# Altium schematic sheet Schema1.SchDoc
size A4; SheetNumber: 1; SheetTotal: 2
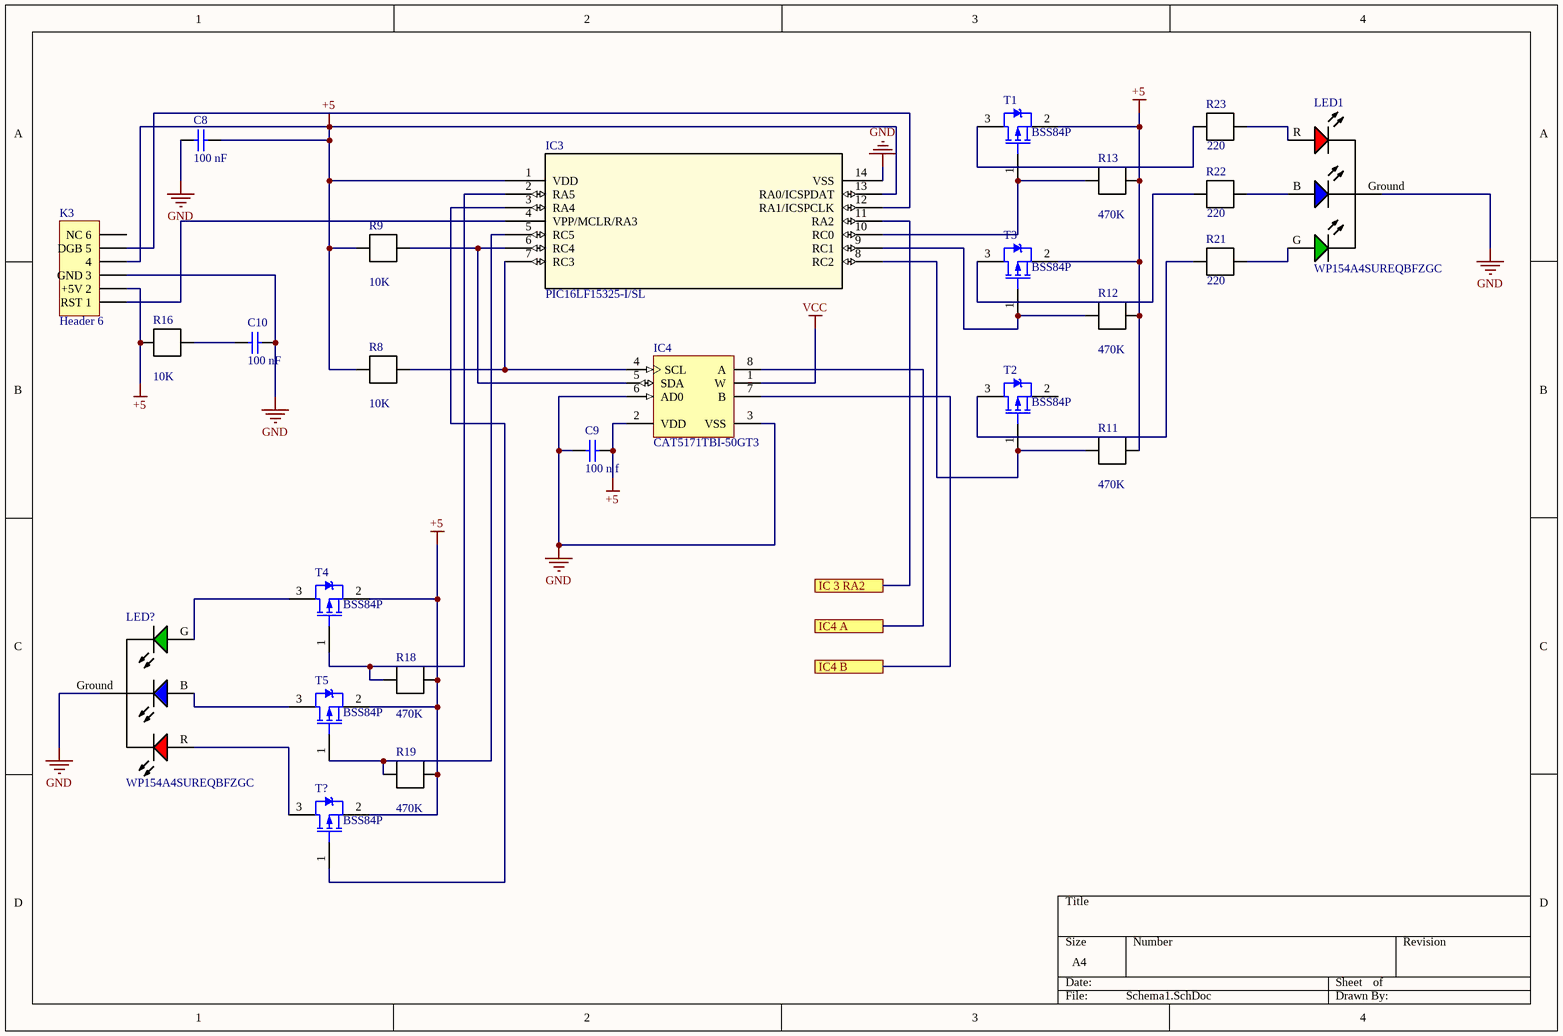
[diagram p0: Schema1.SchDoc]

## Parts
C8  100 nF  [CAPC2013X70X45NL10T25]
C9  100 n f  [CAPC2013X70X45NL10T25]
C10  100 nF  [CAPC2013X70X45NL10T25]
IC3  PIC16LF15325-I/SL  [SOIC14_SL_MCH]
IC4  CAT5171TBI-50GT3  [ONSC-SOT23-8-527AK-01_N]
K3  Header 6  [HDR1X6]
LED1  WP154A4SUREQBFZGC  [KING-WP154A4SUREQBFZGC_V]
LED?  WP154A4SUREQBFZGC  [KING-WP154A4SUREQBFZGC_V]
R8  value 10K  [6-0805_M]
R9  value 10K  [6-0805_M]
R11  value 470K  [6-0805_M]
R12  value 470K  [6-0805_M]
R13  value 470K  [6-0805_M]
R16  value 10K  [6-0805_M]
R18  value 470K  [6-0805_M]
R19  value 470K  [6-0805_M]
R21  value 220  [6-0805_M]
R22  value 220  [6-0805_M]
R23  value 220  [6-0805_M]
T1  BSS84P  [INF-PG-SOT23_N]
T2  BSS84P  [INF-PG-SOT23_N]
T3  BSS84P  [INF-PG-SOT23_N]
T4  BSS84P  [INF-PG-SOT23_N]
T5  BSS84P  [INF-PG-SOT23_N]
T?  BSS84P  [INF-PG-SOT23_N]

## Ports
IC4 A, IC4 B, IC 3 RA2

## Nets
+5: C8.2 C9.2 IC3.1(VDD) IC3.13(RA0/ICSPDAT) IC4.2(VDD) K3.2(+5V_2) K3.4 R8.1 R9.1 R11.2 R12.2 R13.2 R16.1 R18.2 R19.2 T1.2(SOURCE) T3.2(SOURCE) T4.2(SOURCE) T5.2(SOURCE) T?.2(SOURCE)
GND: C8.1 C9.1 C10.2 IC3.14(VSS) IC4.3(VSS) IC4.6(AD0) K3.3(GND_3) LED1.Ground(CATHODE) LED?.Ground(CATHODE)
VCC: IC4.1(W)
IC4 A: IC4.8(A) ; port IC4 A
IC4 B: IC4.7(B) ; port IC4 B
IC 3 RA2: IC3.11(RA2) ; port IC 3 RA2
NetC10_1: C10.1 R16.2
NetIC3_2: IC3.2(RA5) R18.1 T4.1(GATE)
NetIC3_3: IC3.3(RA4) T?.1(GATE)
NetIC3_4: IC3.4(VPP/MCLR/RA3) K3.1(RST_1)
NetIC3_5: IC3.5(RC5) R19.1 T5.1(GATE)
NetIC3_6: IC3.6(RC4) IC4.5(SDA) R9.2
NetIC3_7: IC3.7(RC3) IC4.4(SCL) R8.2
NetIC3_8: IC3.8(RC2) R11.1 T2.1(GATE)
NetIC3_9: IC3.9(RC1) R12.1 T3.1(GATE)
NetIC3_10: IC3.10(RC0) R13.1 T1.1(GATE)
NetIC3_12: IC3.12(RA1/ICSPCLK) K3.5(DGB_5)
NetLED1_B: LED1.B(BLUE) R22.2
NetLED1_G: LED1.G(GREEN) R21.2
NetLED1_R: LED1.R(RED) R23.2
NetLED?_B: LED?.B(BLUE) T5.3(DRAIN)
NetLED?_G: LED?.G(GREEN) T4.3(DRAIN)
NetLED?_R: LED?.R(RED) T?.3(DRAIN)
NetR21_1: R21.1 T2.3(DRAIN)
NetR22_1: R22.1 T3.3(DRAIN)
NetR23_1: R23.1 T1.3(DRAIN)

Not connected (* = marked no-connect by the designer): K3 6(NC_6); T2 2(SOURCE)

## Library data of the parts
C8-C10 = CMP-2007-00889-1: Manufacturer: Murata; Part Number: GRM2165C1H332JA01D
IC3 = PIC16LF15325-I/SL: No Description Available; Vendor: Microchip; Built_By: EMA_Cory; SourceLibrary: Microchip_2020-03-04; Datasheet: http://ww1.microchip.com/downloads/en/DeviceDoc/PIC16-L-F15325-45-Data-Sheet-40001865D.pdf; Manufacturer_Part_Number: PIC16LF15325-I/SL; Copyright: Copyright (C) 2018 Accelerated Designs. All rights reserved; RefDes: RefDes; Type: DEV
IC4 = CMP-1317-00202-1: 256-Position I2C Compatible Digital Potentiometer (POT), -40 to 85 degC, 8-Pin SOT23, Pb-Free, Tape and Reel; Manufacturer: On Semiconductor; # of Pots: 1; VDD Max (V): 5.5; # of Taps: 256; Code_JEDEC: MO-178; RoHS: TRUE; ComponentLink1URL: http://www.onsemi.com/; ComponentLink3URL: http://www.onsemi.com/pub_link/Collateral/527AK.PDF; PackageDescription: 8-Pin Small Outline Transistor, Body 2.9 x 1.6 mm, Pitch 0.65 mm; ComponentLink3Description: Package Specification; PackageReference: SOT23-8-527AK-01; ComponentLink1Description: Manufacturer URL; PartNumber: CAT5171TBI-50GT3; PackageVersion: Rev. A, 03/2009; Packing: Tape and Reel; DatasheetVersion: Rev. 2; Mounting Technology: Surface Mount; ComponentLink2URL: http://www.onsemi.com/pub_link/Collateral/CAT5171-D.PDF; Control Interface: I2C; Type: Potentiometer; ComponentLink2Description: Datasheet
K3 = Header 6: Header, 6-Pin; LatestRevisionDate: 17-Jul-2002; LatestRevisionNote: Re-released for DXP Platform.; Publisher: Altium Limited
LED1 LED? = CMP-2000-07415-1: Full Color LED Lamp, Dominant Wavelength RGB 630 / 525 / 465 nm, -40 to 85 degC, 4-Pin THD, RoHS; Manufacturer: Kingbright; Viewing Angle: 50°; Wavelength - Dominant: 630nm,525nm,465nm; Online Catalog: 5mm,T-13/4(RGB)RoundwithDomedTopLEDLamp; Millicandela Rating: 1300mcdRed,1700mcdGreen,900mcdBlue; Other Names: 754-1615 / WP154A4SUREQBFZGC-ND; Current - Test: 20mA; Wavelength - Peak: 645nm,515nm,460nm; Color: Red,Green,Blue(RGB); Voltage - Forward (Vf) (Typ): 1.9VRed,3.3VGreen,3.3VBlue; Lens Type: Clear; 3D Model: WP154A4SUREQBFZGW.sldprt / WP154A4SUREQBFZGW.pro / WP154A4SUREQBFZGW.igs / WP154A4SUREQBFZGW.stp; Lens Style/Size: RoundwithDomedTop,5mm,T-13/4; Packaging: Bulk; Datasheet URL: https://www.kingbrightusa.com/images/catalog/spec/WP154A4SUREQBFZGC.pdf; Family: LEDIndication-Discrete; Datasheet Version: Rev. 5A, 08/2014; Category: Optoelectronics; Manufacturer URL: http://www.kingbright.com/; Height: 8.60mm; Mounting Type: ThroughHole; Package Reference: WP154A4SUREQBFZGC; Mounting Technology: ThroughHole; Package Description: 4-Pin Through Hole LED, Dia 5.9 mm, Pitch 1.27 mm; Standard Package: 500; Package / Case: Radial-4Leads
R8 R9 R11-R13 R16 R18 R19 R21-R23 = Res1: Resistor; Published: 8-Jun-2000; LatestRevisionDate: 17-Jul-2002; LatestRevisionNote: Re-released for DXP Platform.; PackageReference: AXIAL-0.3; Publisher: Altium Limited; PackageDescription: Axial Device, Thru-Hole; 2 Leads; 0.3 in Pin Spacing; Supplier 1: RSComponents
T1-T5 T? = CMP-1099-00028-1: P-Channel SIPMOS Small-Signal-Transistor, -60 V VDS, -0.17 A ID, -55 to 150 degC, PG-SOT23, Reel, Green; Manufacturer: Infineon; VGS(th) (max): -2Â V; VGS(th) (min): -1Â V; VDS (max): -60Â V; Rth: 350Â K/W; Pto t (max): 0.36Â W; ID (max): -0.17Â A; IDpuls (max): -0.68Â A; RDS (on) (max) (@4.5V): 12,000Â mOhm; QG: 1Â nC; Green: TRUE; RDS (on) (max): 8,000Â mOhm; ComponentLink3URL: http://www.infineon.com/dgdl/SOT23-Package_Overview.pdf?folderId=db3a30431936bc4b0119532290053c66&fileId=db3a30431936bc4b0119533468123c85; ComponentLink3Description: Package Specification; Packing: Reel; PartNumber: BSS84P; ComponentLink2Description: Datasheet; Mounting Technology: Surface Mount; ComponentLink2URL: http://www.infineon.com/dgdl/BSS84P_Rev2.7%5B1%5D.pdf?folderId=db3a304314dca38901154a72e3951a65&fileId=db3a304330f68606013118ac7a9b4549; PackageReference: PG-SOT23; ComponentLink1URL: http://www.infineon.com/; PackageVersion: Apr-08; ComponentLink1Description: Manufacturer URL; PackageDescription: 3-Pin Small Outline Transistor Package, 2.9 x 1.3 mm Body, 0.95 mm Pitch; Halogen-free: TRUE; DatasheetVersion: Rev. 2.7